# EAGLE schematic lamloei_umo32c_r2_1 (EAGLE 7.7.0)
CNAME: lamloei.com/umo32c; CREVISION: R2.1; DESIGNER: LAMLOEI
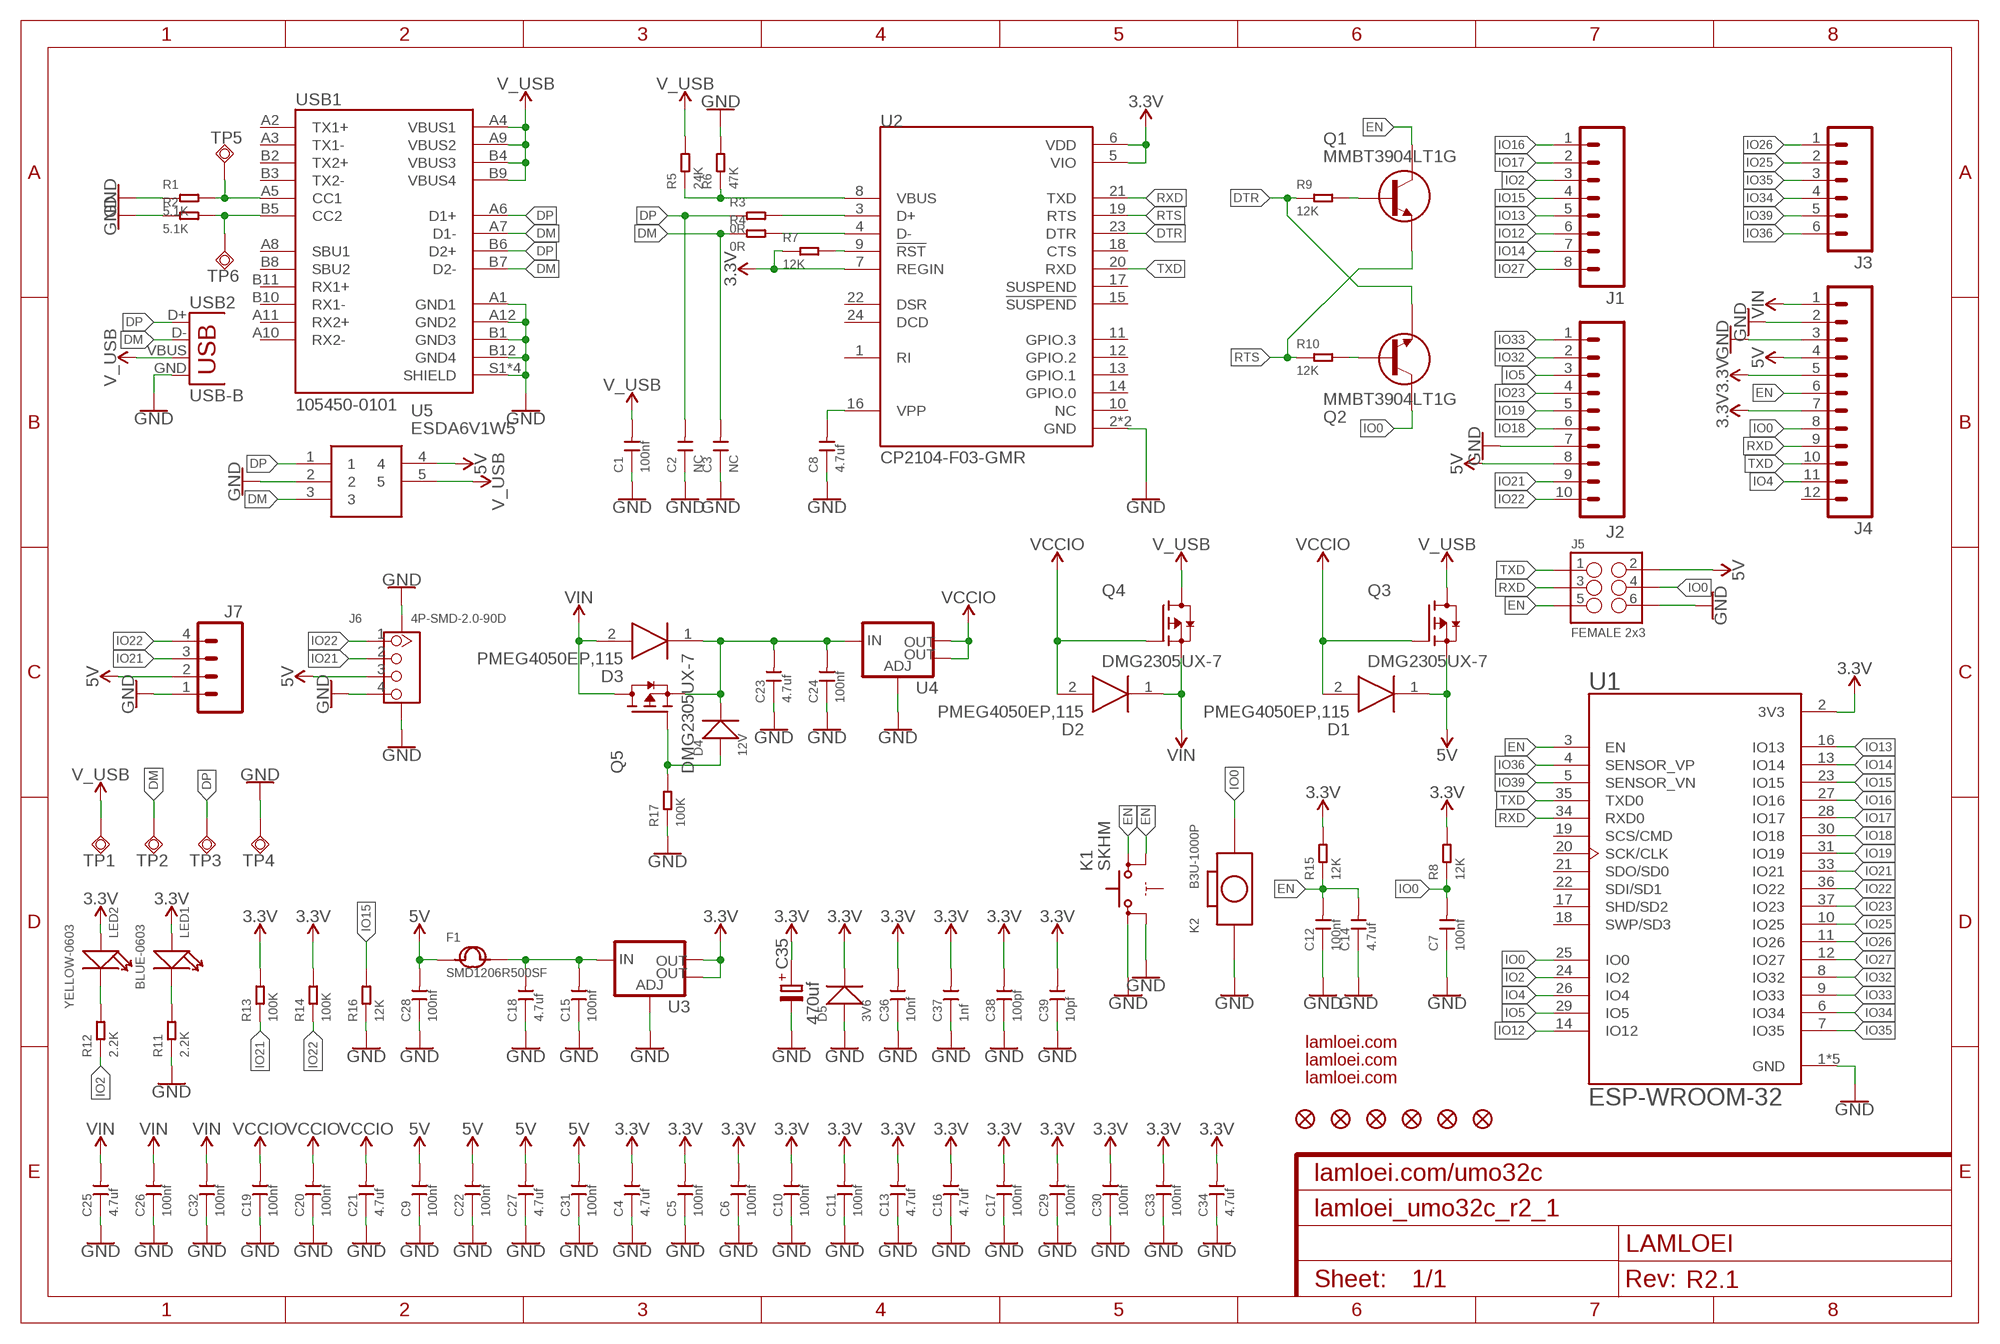
[diagram p0: schematic, sheet 1]

## Parts
C1  100nf  CERAMIC-100NF-25V-10%-X7R(0402)  [C0402]
C2  NC  CERAMIC-47PF-50V-5%-NP0(0402)  [C0402]
C3  NC  CERAMIC-47PF-50V-5%-NP0(0402)  [C0402]
C4  4.7uf  CERAMIC-10UF-25V-10%-X5R(0805)  [C0805]
C5  100nf  CERAMIC-100NF-25V-10%-X7R(0402)  [C0402]
C6  100nf  CERAMIC-100NF-25V-10%-X7R(0402)  [C0402]
C7  100nf  CERAMIC-100NF-25V-10%-X7R(0402)  [C0402]
C8  4.7uf  CERAMIC-10UF-25V-10%-X5R(0805)  [C0805]
C9  100nf  CERAMIC-100NF-25V-10%-X7R(0402)  [C0402]
C10  100nf  CERAMIC-100NF-25V-10%-X7R(0402)  [C0402]
C11  100nf  CERAMIC-100NF-25V-10%-X7R(0402)  [C0402]
C12  100nf  CERAMIC-100NF-25V-10%-X7R(0402)  [C0402]
C13  4.7uf  CERAMIC-10UF-25V-10%-X5R(0805)  [C0805]
C14  4.7uf  CERAMIC-10UF-25V-10%-X5R(0805)  [C0805]
C15  100nf  CERAMIC-100NF-25V-10%-X7R(0402)  [C0402]
C16  4.7uf  CERAMIC-10UF-25V-10%-X5R(0805)  [C0805]
C17  100nf  CERAMIC-100NF-25V-10%-X7R(0402)  [C0402]
C18  4.7uf  CERAMIC-10UF-25V-10%-X5R(0805)  [C0805]
C19  100nf  CERAMIC-100NF-25V-10%-X7R(0402)  [C0402]
C20  100nf  CERAMIC-100NF-25V-10%-X7R(0402)  [C0402]
C21  4.7uf  CERAMIC-10UF-25V-10%-X5R(0805)  [C0805]
C22  100nf  CERAMIC-100NF-25V-10%-X7R(0402)  [C0402]
C23  4.7uf  CERAMIC-10UF-25V-10%-X5R(0805)  [C0805]
C24  100nf  CERAMIC-100NF-25V-10%-X7R(0402)  [C0402]
C25  4.7uf  CERAMIC-10UF-25V-10%-X5R(0805)  [C0805]
C26  100nf  CERAMIC-100NF-25V-10%-X7R(0402)  [C0402]
C27  4.7uf  CERAMIC-10UF-25V-10%-X5R(0805)  [C0805]
C28  100nf  CERAMIC-100NF-25V-10%-X7R(0402)  [C0402]
C29  100nf  CERAMIC-100NF-25V-10%-X7R(0402)  [C0402]
C30  100nf  CERAMIC-100NF-25V-10%-X7R(0402)  [C0402]
C31  100nf  CERAMIC-100NF-25V-10%-X7R(0402)  [C0402]
C32  100nf  CERAMIC-100NF-25V-10%-X7R(0402)  [C0402]
C33  100nf  CERAMIC-100NF-25V-10%-X7R(0402)  [C0402]
C34  4.7uf  CERAMIC-10UF-25V-10%-X5R(0805)  [C0805]
C35  470uf  C-PR-SMD-TE-D  [TE-D-7343]
C36  10nf  CERAMIC-100NF-25V-10%-X7R(0402)  [C0402]
C37  1nf  CERAMIC-100NF-25V-10%-X7R(0402)  [C0402]
C38  100pf  CERAMIC-100NF-25V-10%-X7R(0402)  [C0402]
C39  10pf  CERAMIC-100NF-25V-10%-X7R(0402)  [C0402]
D1  PMEG4050EP,115  [SODFL4725X110N]
D2  PMEG4050EP,115  [SODFL4725X110N]
D3  PMEG4050EP,115  [SODFL4725X110N]
D4  12V  DIODE'1N4148-SMD'  [LL-34]
D5  3V6  DIODE'1N4148-SMD'  [LL-34]
F1  SMD1206R500SF  SMD-PPTC-500MA(1206)  [F1206]
J1  M08SILK_FEMALE_PTH  [1X08]
J2  M10SILK_FEMALE_PTH  [1X10]
J3  M06SILK_FEMALE_PTH  [1X06]
J4  M12PTH  [1X12]
J5  FEMALE 2x3  M03X2FEMALE  [2X3]
J6  4P-SMD-2.0-90D  GROVE-CONNECTOR-SMD-90D(4+2P-2.0)  [HW4-SMD-2.0-90D]
J7  M04LONGPADS  [1X04_LONGPADS]
K1  SKHM  [SKHM]
K2  B3U-1000P  SMD-BUTTON-WITHOUT-BOSS-(2P-3X2.5MM)  [SW2-SMD-3.0X2.5X1.2+0.4MM]
LED1  BLUE-0603  SMD-LED-CLEAR-BLUE(0603)  [LED-0603]
LED2  YELLOW-0603  SMD-LED-CLEAR-BLUE(0603)  [LED-0603]
Q1  MMBT3904LT1G  [SOT23]
Q2  MMBT3904LT1G  [SOT23]
Q3  DMG2305UX-7  [SOT91P240X110-3N_DMG2305UX-7]
Q4  DMG2305UX-7  [SOT91P240X110-3N_DMG2305UX-7]
Q5  DMG2305UX-7  [SOT91P240X110-3N_DMG2305UX-7]
R1  5.1K  SMD-RES-4.7K-5%-1/16W(0402)  [R0402]
R2  5.1K  SMD-RES-4.7K-5%-1/16W(0402)  [R0402]
R3  0R  SMD-RES-22R-1%-1/16W(0402)  [R0402]
R4  0R  SMD-RES-22R-1%-1/16W(0402)  [R0402]
R5  24K  SMD-RES-22R-1%-1/16W(0402)  [R0402]
R6  47K  SMD-RES-22R-1%-1/16W(0402)  [R0402]
R7  12K  SMD-RES-10K-1%-1/16W(0402)  [R0402]
R8  12K  SMD-RES-10K-1%-1/16W(0402)  [R0402]
R9  12K  SMD-RES-10K-1%-1/16W(0402)  [R0402]
R10  12K  SMD-RES-10K-1%-1/16W(0402)  [R0402]
R11  2.2K  SMD-RES-2.7K-1%-1/16W(0402)  [R0402]
R12  2.2K  SMD-RES-2.7K-1%-1/16W(0402)  [R0402]
R13  100K  SMD-RES-10K-1%-1/16W(0402)  [R0402]
R14  100K  SMD-RES-10K-1%-1/16W(0402)  [R0402]
R15  12K  SMD-RES-10K-1%-1/16W(0402)  [R0402]
R16  12K  SMD-RES-10K-1%-1/16W(0402)  [R0402]
R17  100K  SMD-RES-10K-1%-1/16W(0402)  [R0402]
TP1  TPSQTP13SQ  [TP13SQ]
TP2  TPSQTP13SQ  [TP13SQ]
TP3  TPSQTP13SQ  [TP13SQ]
TP4  TPSQTP13SQ  [TP13SQ]
TP5  TPSQTP13SQ  [TP13SQ]
TP6  TPSQTP13SQ  [TP13SQ]
U1  ESP-WROOM-32  [MODULE_ESP-WROOM-32]
U2  CP2104-F03-GMR  [CP2104-F03-GMR]
U3  V_REG_LM1117SOT223  [SOT223]
U4  V_REG_LM1117SOT223  [SOT223]
U5  ESDA6V1W5  [SOT65P210X110-5N]
USB1  105450-0101  [105450-0101]
USB2  USB-B  USBPTH  [USB-B-PTH]
ZFC1  FIDUCIAL1X2  [FIDUCIAL-1X2]
ZFC2  FIDUCIAL1X2  [FIDUCIAL-1X2]
ZFC3  FIDUCIAL1X2  [FIDUCIAL-1X2]
ZFD1  FIDUCIAL1X2  [FIDUCIAL-1X2]
ZFD2  FIDUCIAL1X2  [FIDUCIAL-1X2]
ZFD3  FIDUCIAL1X2  [FIDUCIAL-1X2]
ZL1  LAMLEOI_LOGO_3  [LAMLEOI_LOGO_3]
ZL2  LAMLEOI_LOGO_3  [LAMLEOI_LOGO_3]
ZL3  LAMLOEI_BIGLOGO  [LAMLOEI_BIGLOGO]

## Nets
3.3V: C4.2 C5.2 C6.2 C10.2 C11.2 C13.2 C16.2 C17.2 C29.2 C30.2 C33.2 C34.2 C35.+ C36.2 C37.2 C38.2 C39.2 D5.C(-) J4.5 J4.7 LED1.+ LED2.+ R7.1 R8.2 R13.2 R14.2 R15.2 U1.2(3V3) U2.5(VIO) U2.6(VDD) U2.7(REGIN) U3.2(OUT) U3.4(OUT)
5V: C9.2 C22.2 C27.2 C28.2 C31.2 D1.1(K) F1.1 J2.8 J4.4 J5.2 J6.3 J7.2 Q3.2(S) U5.4
DM: C3.2 R4.1 TP2.TP U5.3 USB1.A7(D1-) USB1.B7(D2-) USB2.D-
DP: C2.2 R3.1 TP3.TP U5.1 USB1.A6(D1+) USB1.B6(D2+) USB2.D+
DTR: Q2.2(E) R9.1 U2.23(DTR)
EN: C12.2 C14.2 J4.6 J5.5 K1.3(S1) K1.4(S2) Q1.3(C) R15.1 U1.3(EN)
GND [gnd]: C1.1 C2.1 C3.1 C4.1 C5.1 C6.1 C7.1 C8.1 C9.1 C10.1 C11.1 C12.1 C13.1 C14.1 C15.1 C16.1 C17.1 C18.1 C19.1 C20.1 C21.1 C22.1 C23.1 C24.1 C25.1 C26.1 C27.1 C28.1 C29.1 C30.1 C31.1 C32.1 C33.1 C34.1 C35.- C36.1 C37.1 C38.1 C39.1 D5.A(+) J2.7 J4.2 J4.3 J5.6 J6.4 J6.SS1 J6.SS2 J7.1 K1.1 K1.2 K2.1 R1.1 R2.1 R6.2 R11.1 R16.1 R17.1 TP4.TP U1.1(GND) U1.1.1(GND) U1.1.2(GND) U1.15(GND) U1.38(GND) U2.2(GND) U2.25(GND) U3.1(ADJ) U4.1(ADJ) U5.2 USB1.A1(GND1) USB1.A12(GND2) USB1.B1(GND3) USB1.B12(GND4) USB1.S1(SHIELD) USB1.S2(SHIELD) USB1.S3(SHIELD) USB1.S4(SHIELD) USB2.GND
IO0: C7.2 J4.8 J5.4 K2.2 Q2.3(C) R8.1 U1.25(IO0)
IO2: J1.3 R12.1 U1.24(IO2)
IO4: J4.11 U1.26(IO4)
IO5: J2.3 U1.29(IO5)
IO12: J1.6 U1.14(IO12)
IO13: J1.5 U1.16(IO13)
IO14: J1.7 U1.13(IO14)
IO15: J1.4 R16.2 U1.23(IO15)
IO16: J1.1 U1.27(IO16)
IO17: J1.2 U1.28(IO17)
IO18: J2.6 U1.30(IO18)
IO19: J2.5 U1.31(IO19)
IO21: J2.9 J6.2 J7.3 R13.1 U1.33(IO21)
IO22: J2.10 J6.1 J7.4 R14.1 U1.36(IO22)
IO23: J2.4 U1.37(IO23)
IO25: J3.2 U1.10(IO25)
IO26: J3.1 U1.11(IO26)
IO27: J1.8 U1.12(IO27)
IO32: J2.2 U1.8(IO32)
IO33: J2.1 U1.9(IO33)
IO34: J3.4 U1.6(IO34)
IO35: J3.3 U1.7(IO35)
IO36: J3.6 U1.4(SENSOR_VP)
IO39: J3.5 U1.5(SENSOR_VN)
N$3: R2.2 TP6.TP USB1.B5(CC2)
N$4: R1.2 TP5.TP USB1.A5(CC1)
N$6: R3.2 U2.3(D+)
N$7: R4.2 U2.4(D-)
N$8: R5.1 R6.1 U2.8(VBUS)
N$9: C15.2 C18.2 F1.2 U3.3(IN)
N$10: LED1.- R11.2
N$11: Q1.1(B) R9.2
N$12: Q2.1(B) R10.2
N$13: C23.2 C24.2 D3.1(K) D4.C(-) Q5.2(S) U4.3(IN)
N$14: R7.2 U2.9(!RST)
N$15: LED2.- R12.2
N$16: C8.2 U2.16(VPP)
N$17: D4.A(+) Q5.1(G) R17.2
RTS: Q1.2(E) R10.1 U2.19(RTS)
RXD: J4.9 J5.3 U1.34(RXD0) U2.21(TXD)
TXD: J4.10 J5.1 U1.35(TXD0) U2.20(RXD)
V_USB: C1.2 Q3.3(D) Q4.3(D) R5.2 TP1.TP U5.5 USB1.A4(VBUS1) USB1.A9(VBUS2) USB1.B4(VBUS3) USB1.B9(VBUS4) USB2.VBUS
VCCIO: C19.2 C20.2 C21.2 D1.2(A) D2.2(A) Q3.1(G) Q4.1(G) U4.2(OUT) U4.4(OUT)
VIN: C25.2 C26.2 C32.2 D2.1(K) D3.2(A) J4.1 Q4.2(S) Q5.3(D)
Unconnected: J4.12 K1.5(G) U1.17(SHD/SD2) U1.18(SWP/SD3) U1.19(SCS/CMD) U1.20(SCK/CLK) U1.21(SDO/SD0) U1.22(SDI/SD1) U2.1(RI) U2.10(NC) U2.11(GPIO.3) U2.12(GPIO.2) U2.13(GPIO.1) U2.14(GPIO.0) U2.15(!SUSPEND) U2.17(SUSPEND) U2.18(CTS) U2.22(DSR) U2.24(DCD) USB1.A2(TX1+) USB1.A3(TX1-) USB1.A8(SBU1) USB1.A10(RX2-) USB1.A11(RX2+) USB1.B2(TX2+) USB1.B3(TX2-) USB1.B8(SBU2) USB1.B10(RX1-) USB1.B11(RX1+)

## Library data of the parts
C1 C5-C7 C9-C12 C15 C17 C19 C20 C22 C24 C26 C28-C33 = Capacitor-2016:CERAMIC-100NF-25V-10%-X7R(0402): 302010024; MPN: CC0402KRX7R8BB104
C2 C3 = Capacitor-2016:CERAMIC-47PF-50V-5%-NP0(0402): 302010007; MPN: CC0402JRNPO9BN470; VALUE: 47PF
C4 C8 C13 C14 C16 C18 C21 C23 C25 C27 C34 = Capacitor-2016:CERAMIC-10UF-25V-10%-X5R(0805): 302010178; MPN: CC0805KKX5R8BB106; VALUE: 10uf
C35 = cap-pan40:C-PR: POLARIZED ELECTROLYTIC/TANTALUM
C36-C39 = Capacitor-2016:CERAMIC-100NF-25V-10%-X7R(0402): 302010024; MPN: CC0402KRX7R8BB104; VALUE: 100nf
D1-D3 = lamloei-PMEG4050EP_115:PMEG4050EP,115: Nexperia PMEG4050EP,115 SMT Schottky Diode, 40V 5A, 2-Pin SOD-128 Source: Datasheet <http://uk.rs-online.com/web/p/products/7805405P>; DESCRIPTION: Nexperia PMEG4050EP,115 SMT Schottky Diode, 40V 5A, 2-Pin SOD-128; HEIGHT: 1.1mm; MANUFACTURER_NAME: Nexperia; MANUFACTURER_PART_NUMBER: PMEG4050EP,115; RS_PART_NUMBER: 7805405P; RS_PRICE-STOCK: http://uk.rs-online.com/web/p/products/7805405P
D4 D5 = Seeed-OPL-Diode:DIODE*
F1 = Fuse-2016:SMD-PPTC-500MA(1206): 307010002; MPN: SMD1206R500SF
J1 = SparkFun-Connectors2:M08: Header 8 Standard 8-pin 0.1" header. Use with straight break away headers (SKU : PRT-00116), right angle break away headers (PRT-00553), swiss pins (PRT-00743), machine pins (PRT-00117), and female headers (PRT-00115).; PROD_ID: CONN-08438
J2 = SparkFun-Connectors2:M10: Header 10 Standard 10-pin 0.1" header. Use with straight break away headers (SKU : PRT-00116), right angle break away headers (PRT-00553), swiss pins (PRT-00743), machine pins (PRT-00117), and female headers (PRT-00115).; PROD_ID: CONN-11563
J3 = SparkFun-Connectors2:M06: Header 6 Standard 6-pin 0.1" header. Use with straight break away headers (SKU : PRT-00116), right angle break away headers (PRT-00553), swiss pins (PRT-00743), machine pins (PRT-00117), and female headers (PRT-00115). Molex polarized connector foot print use with SKU : PRT-08094 with associated crimp pins and housings. NOTES ON THE VARIANTS LOCK and LOCK_LONGPADS... This footprint was designed to help hold the alignment of a through-hole component (i.e. 6-pin header) while soldering it into place. You may notice that each hole has been shifted either up or down by 0.005 of an inch from it's more standard position (which is a perfectly straight line). This slight alteration caused the pins (the squares in the middle) to touch the edges of the holes. Because they are alternating, it causes a "brace" to hold the component in place. 0.005 has proven to be the perfect amount of "off-center" position when using our standard breakaway headers. Although looks a little odd when you look at the bare footprint, once you have a header in there, the alteration is very hard to notice. Also,if you push a header all the way into place, it is covered up entirely on the bottom side. This idea of altering the position of holes to aid alignment will be further integrated into the Sparkfun Library for other footprints. It can help hold any component with 3 or more connection pins.; PROD_ID: CONN-08437
J4 = SparkFun-Connectors2:M12: Header 12 Standard 12-pin 0.1" header. Use with straight break away headers (SKU : PRT-00116), right angle break away headers (PRT-00553), swiss pins (PRT-00743), machine pins (PRT-00117), and female headers (PRT-00115).
J5 = SparkFun-Connectors:M03X2: 2x3 .1" header. Shrouded, with keying- CONN-10681 SMT- CONN-11415 Pogo pins- HW-11044; PROD_ID: CONN-11566
J6 = Seeed-OPL-Connector:GROVE-CONNECTOR-SMD-90D(4+2P-2.0): 320110032
J7 = SparkFun-Connectors:M04: Header 4 Standard 4-pin 0.1" header. Use with straight break away headers (SKU : PRT-00116), right angle break away headers (PRT-00553), swiss pins (PRT-00743), machine pins (PRT-00117), and female headers (PRT-00115). Molex polarized connector foot print use with SKU : PRT-08231 with associated crimp pins and housings. 1MM SMD Version SKU: PRT-10208; PROD_ID: CONN-09696
K1 = switch-alps:SKHM: TACT SWITCH
K2 = Seeed-OPL-Button4:SMD-BUTTON-WITHOUT-BOSS-(2P-3X2.5MM): 311020047
LED1 = Seeed-OPL-Diode:SMD-LED-CLEAR-BLUE(0603): 304090045; MPN: 19-217-BHC-ZL1M2RY-3T
LED2 = Seeed-OPL-Diode:SMD-LED-CLEAR-BLUE(0603): 304090045; MPN: 19-217-BHC-ZL1M2RY-3T; VALUE: BLUE-0603
Q1 Q2 = MMBT3904LT1G:MMBT3904LT1G: http://octopart.com/mmbt3904lt1g-on+semiconductor-3280; AVAILABILITY: Unavailable; MF: ON Semiconductor; MP: MMBT3904LT1G; PACKAGE: SOT-23-3 NXP Semiconductors; PRICE: None
Q3-Q5 = lamloei-DMG2305UX-7:DMG2305UX-7: DMG2305UX Series 20 V 65 Ohms P-Ch Enhancement Mode Mosfet - SOT-23-3; AVAILABILITY: Unavailable; DESCRIPTION: P-Channel 20V 4.2A _Ta_ 1.4W _Ta_ Surface Mount SOT-23; MF: Diodes Inc.; MP: DMG2305UX-7; PACKAGE: SOT-23-3 Diodes Inc.; PRICE: None
R1 R2 = Resistor-2016:SMD-RES-4.7K-5%-1/16W(0402): 301010010; MPN: RC0402JR-074K7L; VALUE: 4.7K
R3-R6 = Resistor-2016:SMD-RES-22R-1%-1/16W(0402): 301010052; MPN: RC0402FR-0722RL; VALUE: 22R
R7-R10 R13-R17 = Resistor-2016:SMD-RES-10K-1%-1/16W(0402): 301010047; MPN: RC0402FR-0710KL; VALUE: 10K 1/16W
R11 R12 = Resistor-2016:SMD-RES-2.7K-1%-1/16W(0402): 301010671; MPN: RC0402FR-072K7L; VALUE: 2.7K 1/16W
TP1-TP6 = testpad:TPSQ: Test pad
U1 = ESP-WROOM-32-nodelite:ESP-WROOM-32: Module: combo; GPIO, I2C x2, I2S x2, SDIO, SPI x3, UART x3; 19.5dBm; AVAILABILITY: Warning; DESCRIPTION: Module: combo; GPIO, I2C x2, I2S x2, SDIO, SPI x3, UART x3; 19.5dBm; MF: Olimex LTD; MP: ESP-WROOM-32; PACKAGE: Module Espressif Systems; PRICE: 4.57 USD
U2 = lamloei-CP2104-F03-GMR:CP2104-F03-GMR: USB-to-UART 1-CH 576byte FIFO 3.3V 24-Pin QFN EP T/R; BE: Basic Part; DESCRIPTION: USB 1/1 2MBPS 3V ~ 3.6V QFN-24_4X4X05P ROHS; LCSC_PART: C47742; MF: Silicon Labs; MP: CP2104-F03-GMR; PACKAGE: QFN-24_EP_4.0x4.0x0.5P; PRICE: $1.2119; PRICE_DATE: 201912
U3 U4 = SparkFun-PowerIC-2:V_REG_LM1117: Voltage Regulator LM1117 Standard adjustable voltage regulator but in SMD form. Spark Fun Electronics SKU : COM-00595; PROD_ID: VREG-08170
U5 = ESDA6V1W5:ESDA6V1W5: TVS Diode Array Uni-Directional ESDA6V1W5 Quad, 150W, SOT-323 5-Pin Source: Datasheet <http://uk.rs-online.com/web/p/products/1685770>; ALLIED_NUMBER: 70389948; DESCRIPTION: TVS Diode Array Uni-Directional ESDA6V1W5 Quad, 150W, SOT-323 5-Pin; HEIGHT: 1.1mm; MANUFACTURER_NAME: STMicroelectronics; MANUFACTURER_PART_NUMBER: ESDA6V1W5; RS_PART_NUMBER: 1685770
USB1 = lamloei-105450-0101:105450-0101: USB Shielded I/O Receptacle; Type C; Right Angle; Surface Mount; Gold over Nickel; AVAILABILITY: Unavailable; DESCRIPTION: USB Shielded I/O Receptacle; Type C; Right Angle; Surface Mount; Gold over Nickel; MF: Molex; MP: 105450-0101; PACKAGE: None; PRICE: None
USB2 = SparkFun-Connectors-Bighole:USB: USB Connectors USB-B-PTH is fully proven SKU : PRT-00139/CONN-08278 USB-miniB is fully proven SKU : PRT-00587 USB-A-PCB is untested. USB-A-H is throughly reviewed, but untested. Spark Fun Electronics SKU : PRT-00437 USB-B-SMT is throughly reviewed, but untested. Needs silkscreen touching up. USB-A-S has not been used/tested USB-MB-H has not been used/tested USB-MICROB has been used. CONN-09505; PROD_ID: CONN-08278
ZFC1-ZFC3 ZFD1-ZFD3 = SparkFun-Aesthetics:FIDUCIAL: Fiducial Alignment Points Point-of-reference for pick-and-place machines and other optical instruments.
ZL1 ZL2 = lamloei_logo_3:LAMLEOI_LOGO_3: lamloei
ZL3 = lamloei_logo_3:LAMLOEI_BIGLOGO

## Net classes
0 default: width 0.254 mm, clearance 0.152 mm
1 power: width 0.61 mm, drill 0.61 mm, clearance 0.152 mm
2 gnd: width 0.305 mm, drill 0.483 mm, clearance 0.152 mm
3 usbvcc: width 0.508 mm, drill 0.61 mm, clearance 0.152 mm
4 aref: width 0.406 mm, drill 0.61 mm, clearance 0.152 mm